# EAGLE schematic PRoMo_Base_CMS (EAGLE 6.4)
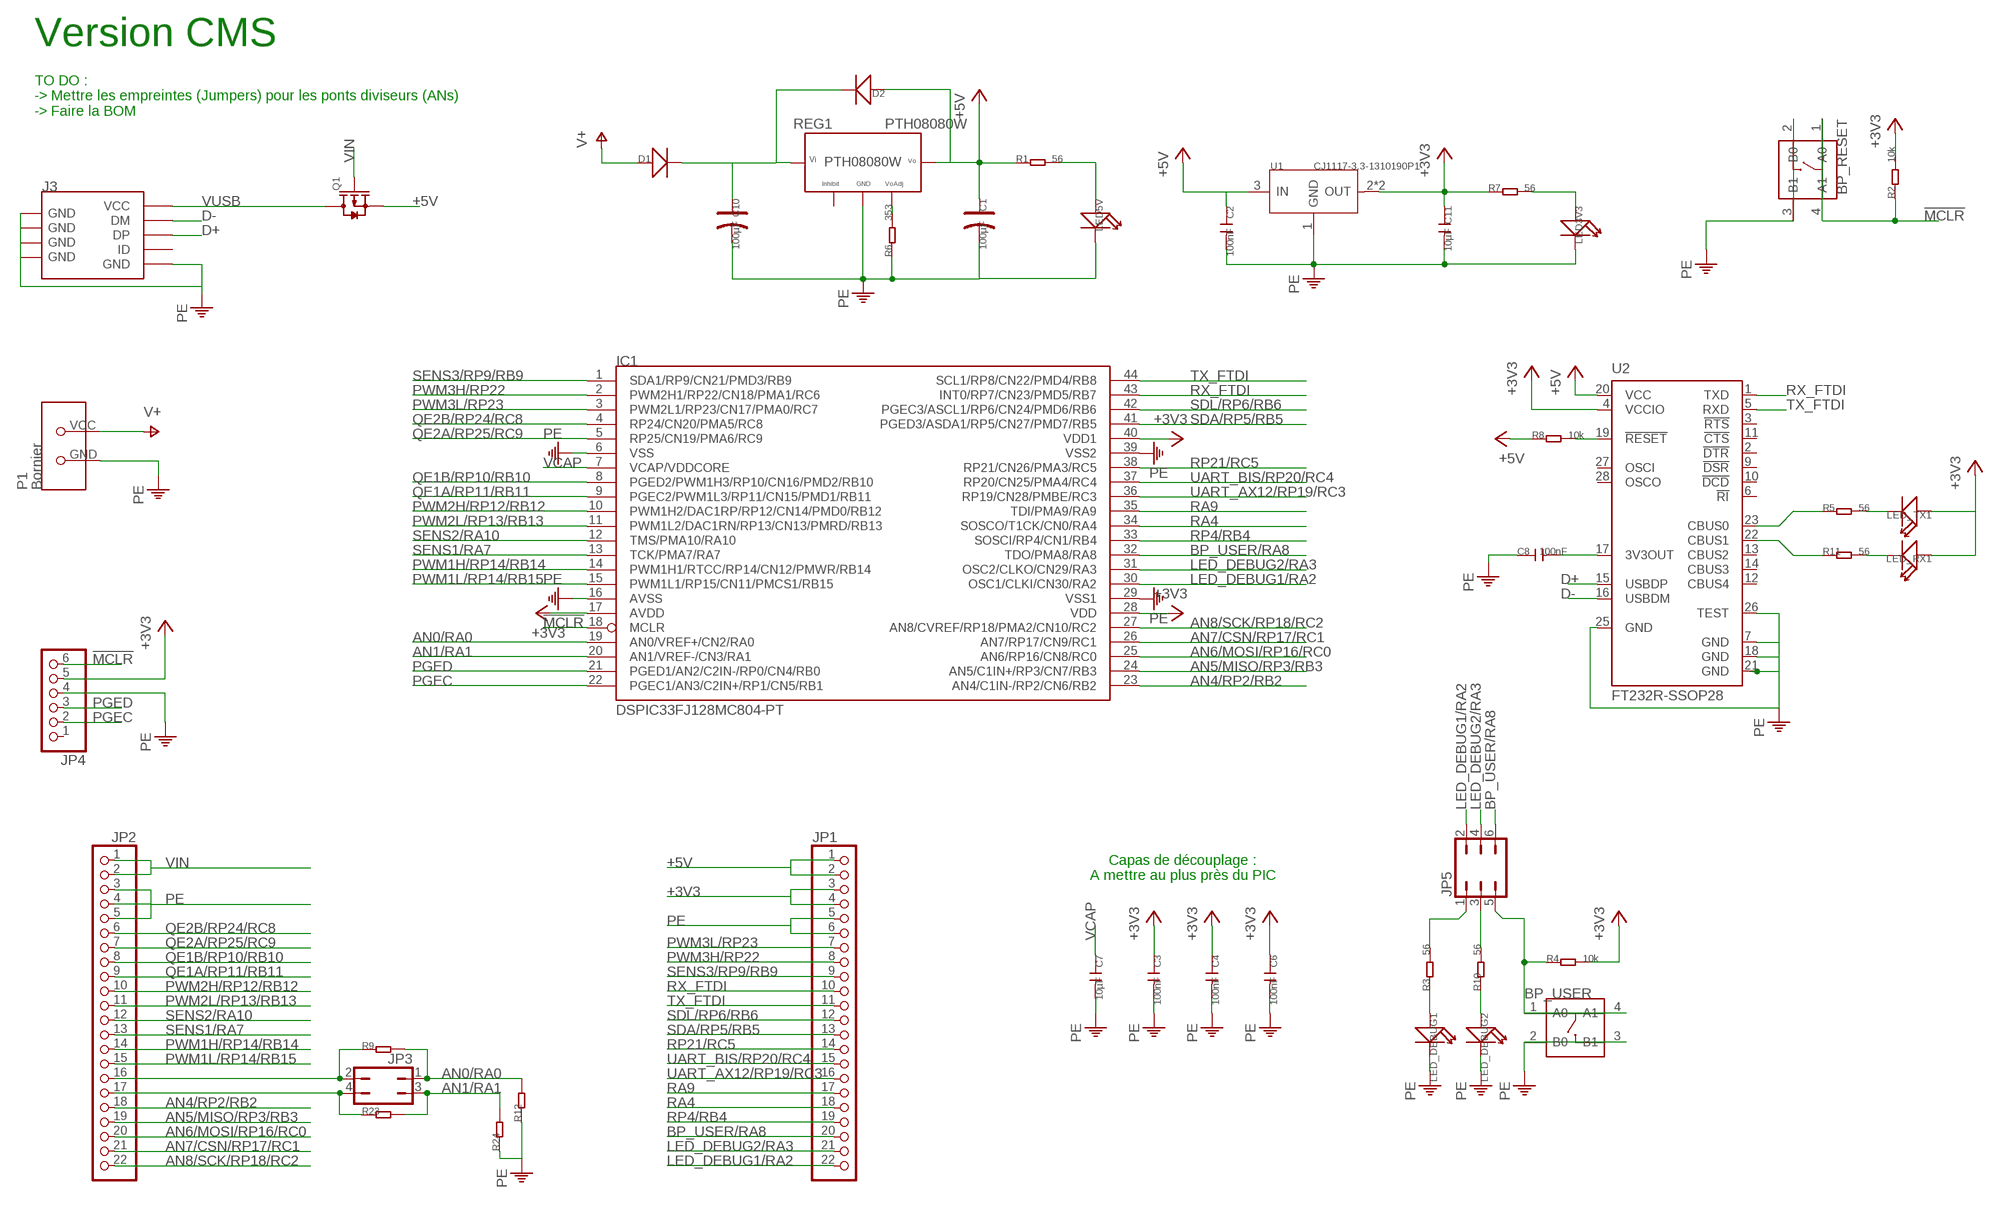
[diagram p0: schematic, sheet 1]

## Parts
BP_RESET  BUTTON-4P-6.2X6.2  [4P-6.2X6.2]
BP_USER  BUTTON-4P-6.2X6.2  [4P-6.2X6.2]
C1  100µF  CAP-D5.3/2.0  [ELECTRO-5.3MM]
C2  100nF  C-0805  [C0805]
C3  100nF  C-0805  [C0805]
C4  100nF  C-0805  [C0805]
C6  100nF  C-0805  [C0805]
C7  10µF  C-0805  [C0805]
C8  100nF  C-0805  [C0805]
C10  100µF  CAP-D5.3/2.0  [ELECTRO-5.3MM]
C11  10µF  C-0805  [C0805]
D1  D'1206'  [SOD123]
D2  D'1206'  [SOD123]
IC1  DSPIC33FJ128MC804-PT  [TQFP44]
J3  USB-MINIUSB-5P-TH  [MINI-5P]
JP1  PINHD-1X22  [1X22]
JP2  PINHD-1X22  [1X22]
JP3  JP2Q  [JP2Q]
JP4  PINHD-1X6/90  [1X06/90]
JP5  JP3Q  [JP3Q]
LED3V3  LED'1206'  [LED-1206]
LED5V  LED'1206'  [LED-1206]
LED_DEBUG1  LED'1206'  [LED-1206]
LED_DEBUG2  LED'1206'  [LED-1206]
LED_RX1  LED'1206'  [LED-1206]
LED_TX1  LED'1206'  [LED-1206]
P1  Bornier  BORNIER_3.5MM  [BORNIER_COUDEE_3.5]
Q1  MOSFET-P'SI2323CDS/SI2305DS<BR>'  [SOT23]
R1  56  R-0805  [R0805]
R2  10k  R-0805  [R0805]
R3  56  R-0805  [R0805]
R4  10k  R-0805  [R0805]
R5  56  R-0805  [R0805]
R6  353  R-0204/7  [R0204/7]
R7  56  R-0805  [R0805]
R8  10k  R-0805  [R0805]
R9  R-0805  [R0805]
R10  56  R-0805  [R0805]
R11  56  R-0805  [R0805]
R12  R-0805  [R0805]
R23  R-0805  [R0805]
R24  R-0805  [R0805]
REG1  PTH08080W  [PTH08080W]
U1  CJ1117-3.3-1310190P1  [SOT223]
U2  FT232R-SSOP28  [SSOP28]

## Nets
!MCLR!: BP_RESET.1(A0) BP_RESET.4(A1) IC1.18(MCLR) JP4.6 R2.1
+3V3: C3.1 C4.1 C6.1 C11.1 IC1.17(AVDD) IC1.28(VDD) IC1.40(VDD1) JP1.3 JP1.4 JP4.5 LED_RX1.+ LED_TX1.+ R2.2 R4.2 R7.1 U1.2(OUT) U1.TER(OUT) U2.4(VCCIO)
+5V: C1.+ C2.1 D2.+ JP1.1 JP1.2 Q1.2(S) R1.1 R8.1 REG1.P$3(3_VO) U1.3(IN) U2.20(VCC)
AN0/RA0: IC1.19(AN0/VREF+/CN2/RA0) JP3.1 R9.2 R12.2
AN1/RA1: IC1.20(AN1/VREF-/CN3/RA1) JP3.3 R23.2 R24.2
AN4/RP2/RB2: IC1.23(AN4/C1IN-/RP2/CN6/RB2) JP2.18
AN5/MISO/RP3/RB3: IC1.24(AN5/C1IN+/RP3/CN7/RB3) JP2.19
AN6/MOSI/RP16/RC0: IC1.25(AN6/RP16/CN8/RC0) JP2.20
AN7/CSN/RP17/RC1: IC1.26(AN7/RP17/CN9/RC1) JP2.21
AN8/SCK/RP18/RC2: IC1.27(AN8/CVREF/RP18/PMA2/CN10/RC2) JP2.22
BP: BP_USER.1(A0) BP_USER.4(A1) JP5.5 R4.1
BP_USER/RA8: IC1.32(TDO/PMA8/RA8) JP1.20 JP5.6
D+: J3.DP U2.15(USBDP)
D-: J3.DM U2.16(USBDM)
LED_DEBUG1/RA2: IC1.30(OSC1/CLKI/CN30/RA2) JP1.22
LED_DEBUG2/RA3: IC1.31(OSC2/CLKO/CN29/RA3) JP1.21 JP5.4
N$2: R6.2 REG1.P$4(4_VOADJ)
N$3: LED5V.+ R1.2
N$5: LED_DEBUG1.+ R3.1
N$6: JP5.1 R3.2
N$7: LED3V3.+ R7.2
N$8: C8.2 U2.17(3V3OUT)
N$9: R8.2 U2.19(!RESET)
N$10: JP2.17 JP3.4 R23.1
N$11: JP2.16 JP3.2 R9.1
N$12: R11.1 U2.22(CBUS1)
N$13: R5.1 U2.23(CBUS0)
N$14: LED_DEBUG2.+ R10.1
N$15: LED_TX1.- R5.2
N$16: JP5.3 R10.2
N$17: LED_RX1.- R11.2
PE: BP_RESET.2(B0) BP_RESET.3(B1) BP_USER.2(B0) BP_USER.3(B1) C1.- C2.2 C3.2 C4.2 C6.2 C7.2 C8.1 C10.- C11.2 IC1.6(VSS) IC1.16(AVSS) IC1.29(VSS1) IC1.39(VSS2) J3.GND J3.S1(GND) J3.S2(GND) J3.S3(GND) J3.S4(GND) JP1.5 JP1.6 JP2.3 JP2.4 JP2.5 JP4.4 LED3V3.- LED5V.- LED_DEBUG1.- LED_DEBUG2.- P1.GND R6.1 R12.1 R24.1 REG1.P$2(2_GND) U1.1(GND) U2.7(GND) U2.18(GND) U2.21(GND) U2.25(GND) U2.26(TEST)
PGEC: IC1.22(PGEC1/AN3/C2IN+/RP1/CN5/RB1) JP4.2
PGED: IC1.21(PGED1/AN2/C2IN-/RP0/CN4/RB0) JP4.3
PWM1H/RP14/RB14: IC1.14(PWM1H1/RTCC/RP14/CN12/PMWR/RB14) JP2.14
PWM1L/RP14/RB15: IC1.15(PWM1L1/RP15/CN11/PMCS1/RB15) JP2.15
PWM2H/RP12/RB12: IC1.10(PWM1H2/DAC1RP/RP12/CN14/PMD0/RB12) JP2.10
PWM2L/RP13/RB13: IC1.11(PWM1L2/DAC1RN/RP13/CN13/PMRD/RB13) JP2.11
PWM3H/RP22: IC1.2(PWM2H1/RP22/CN18/PMA1/RC6) JP1.8
PWM3L/RP23: IC1.3(PWM2L1/RP23/CN17/PMA0/RC7) JP1.7
QE1A/RP11/RB11: IC1.9(PGEC2/PWM1L3/RP11/CN15/PMD1/RB11) JP2.9
QE1B/RP10/RB10: IC1.8(PGED2/PWM1H3/RP10/CN16/PMD2/RB10) JP2.8
QE2A/RP25/RC9: IC1.5(RP25/CN19/PMA6/RC9) JP2.7
QE2B/RP24/RC8: IC1.4(RP24/CN20/PMA5/RC8) JP2.6
RA4: IC1.34(SOSCO/T1CK/CN0/RA4) JP1.18
RA9: IC1.35(TDI/PMA9/RA9) JP1.17
RP4/RB4: IC1.33(SOSCI/RP4/CN1/RB4) JP1.19
RP21/RC5: IC1.38(RP21/CN26/PMA3/RC5) JP1.14
RX_FTDI: IC1.43(INT0/RP7/CN23/PMD5/RB7) JP1.10 U2.1(TXD)
SDA/RP5/RB5: IC1.41(PGED3/ASDA1/RP5/CN27/PMD7/RB5) JP1.13
SDL/RP6/RB6: IC1.42(PGEC3/ASCL1/RP6/CN24/PMD6/RB6) JP1.12
SENS1/RA7: IC1.13(TCK/PMA7/RA7) JP2.13
SENS2/RA10: IC1.12(TMS/PMA10/RA10) JP2.12
SENS3/RP9/RB9: IC1.1(SDA1/RP9/CN21/PMD3/RB9) JP1.9
TX_FTDI: IC1.44(SCL1/RP8/CN22/PMD4/RB8) JP1.11 U2.5(RXD)
UART_AX12/RP19/RC3: IC1.36(RP19/CN28/PMBE/RC3) JP1.16
UART_BIS/RP20/RC4: IC1.37(RP20/CN25/PMA4/RC4) JP1.15
V+: D1.+ P1.VCC
VCAP: C7.1 IC1.7(VCAP/VDDCORE)
VIN: C10.+ D1.- D2.- JP2.1 JP2.2 Q1.1(G) REG1.P$1(1_VI)
VUSB: J3.VCC Q1.3(D)
Unconnected: J3.ID JP4.1 JP5.2 REG1.P$5(5_INHIBIT) U2.2(!DTR) U2.3(!RTS) U2.6(!RI) U2.9(!DSR) U2.10(!DCD) U2.11(!CTS) U2.12(CBUS4) U2.13(CBUS2) U2.14(CBUS3) U2.27(OSCI) U2.28(OSCO)

## Notes on the sheet
- Version CMS
- TO DO : 
  -> Mettre les empreintes (Jumpers) pour les ponts diviseurs (ANs)
  -> Faire la BOM
- Capas de découplage :
  A mettre au plus près du PIC

## Library data of the parts
BP_RESET BP_USER = Discrete:BUTTON-4P
C1 C10 = Discrete:CAP*: Electrolytic Capacitors,Tantalum Capacitors and Super Capacitors
C2-C4 C6-C8 C11 = Discrete:C*: Ceramic Capacitors
D1 D2 = Discrete:D*
IC1 = microchip-dspic33fjxxmc:DSPIC33FJ128MC804: dsPIC33FJ32MC302/304, dsPIC33FJ64MCX02/X04, AND dsPIC33FJ128MCX02/X04 High-Performance, 16-bit Digital Signal Controllers Package:44 Pin TQFP Operating Range: * Up to 40 MIPS operation (at 3.0V -3.6V): - Industrial temperature range (-40°C to +85°C) - Extended temperature range (-40°C to +125°C) High-Performance DSC CPU: * Modified Harvard architecture * C compiler optimized instruction set * 16-bit wide data path * 24-bit wide instructions * Linear program memory addressing up to 4M instruction words * Linear data memory addressing up to 64 Kbytes * 83 base instructions: mostly 1 word/1 cycle * Two 40-bit accumulators with rounding and saturation options * Flexible and powerful addressing modes: - Indirect - Modulo - Bit-Reversed * Software stack * 16 x 16 fractional/integer multiply operations * 32/16 and 16/16 divide operations * Single-cycle multiply and accumulate: - Accumulator write back for DSP operations - Dual data fetch * Up to ±16-bit shifts for up to 40-bit data Direct Memory Access (DMA): * 8-channel hardware DMA * Up to 2 Kbytes dual ported DMA buffer area (DMA RAM) to store data transferred via DMA: - Allows data transfer between RAM and a peripheral while CPU is executing code (no cycle stealing) * Most peripherals support DMA Timers/Capture/Compare/PWM: * Timer/Counters, up to five 16-bit timers: - Can pair up to make two 32-bit timers - One timer runs as a Real-Time Clock with an external 32.768 kHz oscillator - Programmable prescaler * Input Capture (up to four channels): - Capture on up, down or both edges - 16-bit capture input functions - 4-deep FIFO on each capture * Output Compare (up to four channels): - Single or Dual 16-bit Compare mode - 16-bit Glitchless PWM mode * Hardware Real-Time Clock/Calendar (RTCC): - Provides clock, calendar, and alarm functions Interrupt Controller: * 5-cycle latency * Up to 53 available interrupt sources * Up to three external interrupts * Seven programmable priority levels * Five processor exceptions Digital I/O: * Peripheral pin Select functionality * Up to 35 programmable digital I/O pins * Wake-up/Interrupt-on-Change for up to 31 pins * Output pins can drive from 3.0V to 3.6V * Up to 5V output with open drain configuration * All digital input pins are 5V tolerant * 4 mA sink on all I/O pins On-Chip Flash and SRAM: * Flash program memory (up to 128 Kbytes) * Data SRAM (up to 16 Kbytes) * Boot, Secure, and General Security for program Flash System Management: * Flexible clock options: - External, crystal, resonator, internal RC - Fully integrated Phase-Locked Loop (PLL) - Extremely low jitter PLL * Power-up Timer * Oscillator Start-up Timer/Stabilizer * Watchdog Timer with its own RC oscillator * Fail-Safe Clock Monitor * Reset by multiple sources Power Management: * On-chip 2.5V voltage regulator * Switch between clock sources in real time * Idle, Sleep, and Doze modes with fast wake-up Analog-to-Digital Converters (ADCs): * 10-bit, 1.1 Msps or 12-bit, 500 Ksps conversion: - Two and four simultaneous samples (10-bit ADC) - Up to nine input channels with auto-scanning - Conversion start can be manual or synchronized with one of four trigger sources - Conversion possible in Sleep mode - ±2 LSb max integral nonlinearity - ±1 LSb max differential nonlinearity Audio Digital-to-Analog Converter (DAC): - 16-bit Dual Channel DAC module - 100 Ksps maximum sampling rate - Second-Order Digital Delta-Sigma Modulator Comparator Module: * Two analog comparators with programmable input/output configuration CMOS Flash Technology: * Low-power, high-speed Flash technology * Fully static design * 3.3V (±10%) operating voltage * Industrial and Extended temperature * Low power consumption Motor Control Peripherals: * 6-channel 16-bit Motor Control PWM: - Three duty cycle generators - Independent or Complementary mode - Programmable dead-time and output polarity - Edge-aligned or center-aligned - Manual output override control - One Fault input - Trigger for ADC conversions - PWM frequency for 16-bit resolution (@ 40 MIPS) = 1220 Hz for Edge-Aligned mode, 610 Hz for Center-Aligned mode - PWM frequency for 11-bit resolution (@ 40 MIPS) = 39.1 kHz for Edge-Aligned mode, 19.55 kHz for Center-Aligned mode * 2-channel 16-bit Motor Control PWM: - One duty cycle generator - Independent or Complementary mode - Programmable dead time and output polarity - Edge-aligned or center-aligned - Manual output override control - One Fault input - Trigger for ADC conversions - PWM frequency for 16-bit resolution (@ 40 MIPS) = 1220 Hz for Edge-Aligned mode, 610 Hz for Center-Aligned mode - PWM frequency for 11-bit resolution (@ 40 MIPS) = 39.1 kHz for Edge-Aligned mode, 19.55 kHz for Center-Aligned mode * 2-Quadrature Encoder Interface module: - Phase A, Phase B, and index pulse input - 16-bit up/down position counter - Count direction status - Position Measurement (x2 and x4) mode - Programmable digital noise filters on inputs - Alternate 16-bit Timer/Counter mode - Interrupt on position counter rollover/underflow
J3 = Connector :USB-MINIUSB-5P
JP1 JP2 = pinhead:PINHD-1X22: PIN HEADER
JP3 = jumper:JP2Q: JUMPER
JP4 = pinhead:PINHD-1X6: PIN HEADER
JP5 = jumper:JP3Q: JUMPER
LED3V3 LED5V LED_DEBUG1 LED_DEBUG2 LED_RX1 LED_TX1 = Discrete:LED*
P1 = Perso:BORNIER_3.5MM: Bornier 3.5mm Bornier emfichable 3.5mm coudée
Q1 = Discrete:MOSFET-P
R1-R12 R23 R24 = Discrete:R*
REG1 = Perso:PTH08080W: TI Régulateur PTH08080W : Vin = [4.5 ; 18] V, Vout = [0.9 ; 5.5] V, Iout = 2.25 A.
U1 = OPL:CJ1117-3.3: 1A Low Dropout Linear Regulator
U2 = IC:FT232R: USB UART IC Source: http://www.ftdichip.com/Documents/DataSheets/DS_FT232R_v104.pdf